# EAGLE design mtp zesilovac (EAGLE 7.2.0)
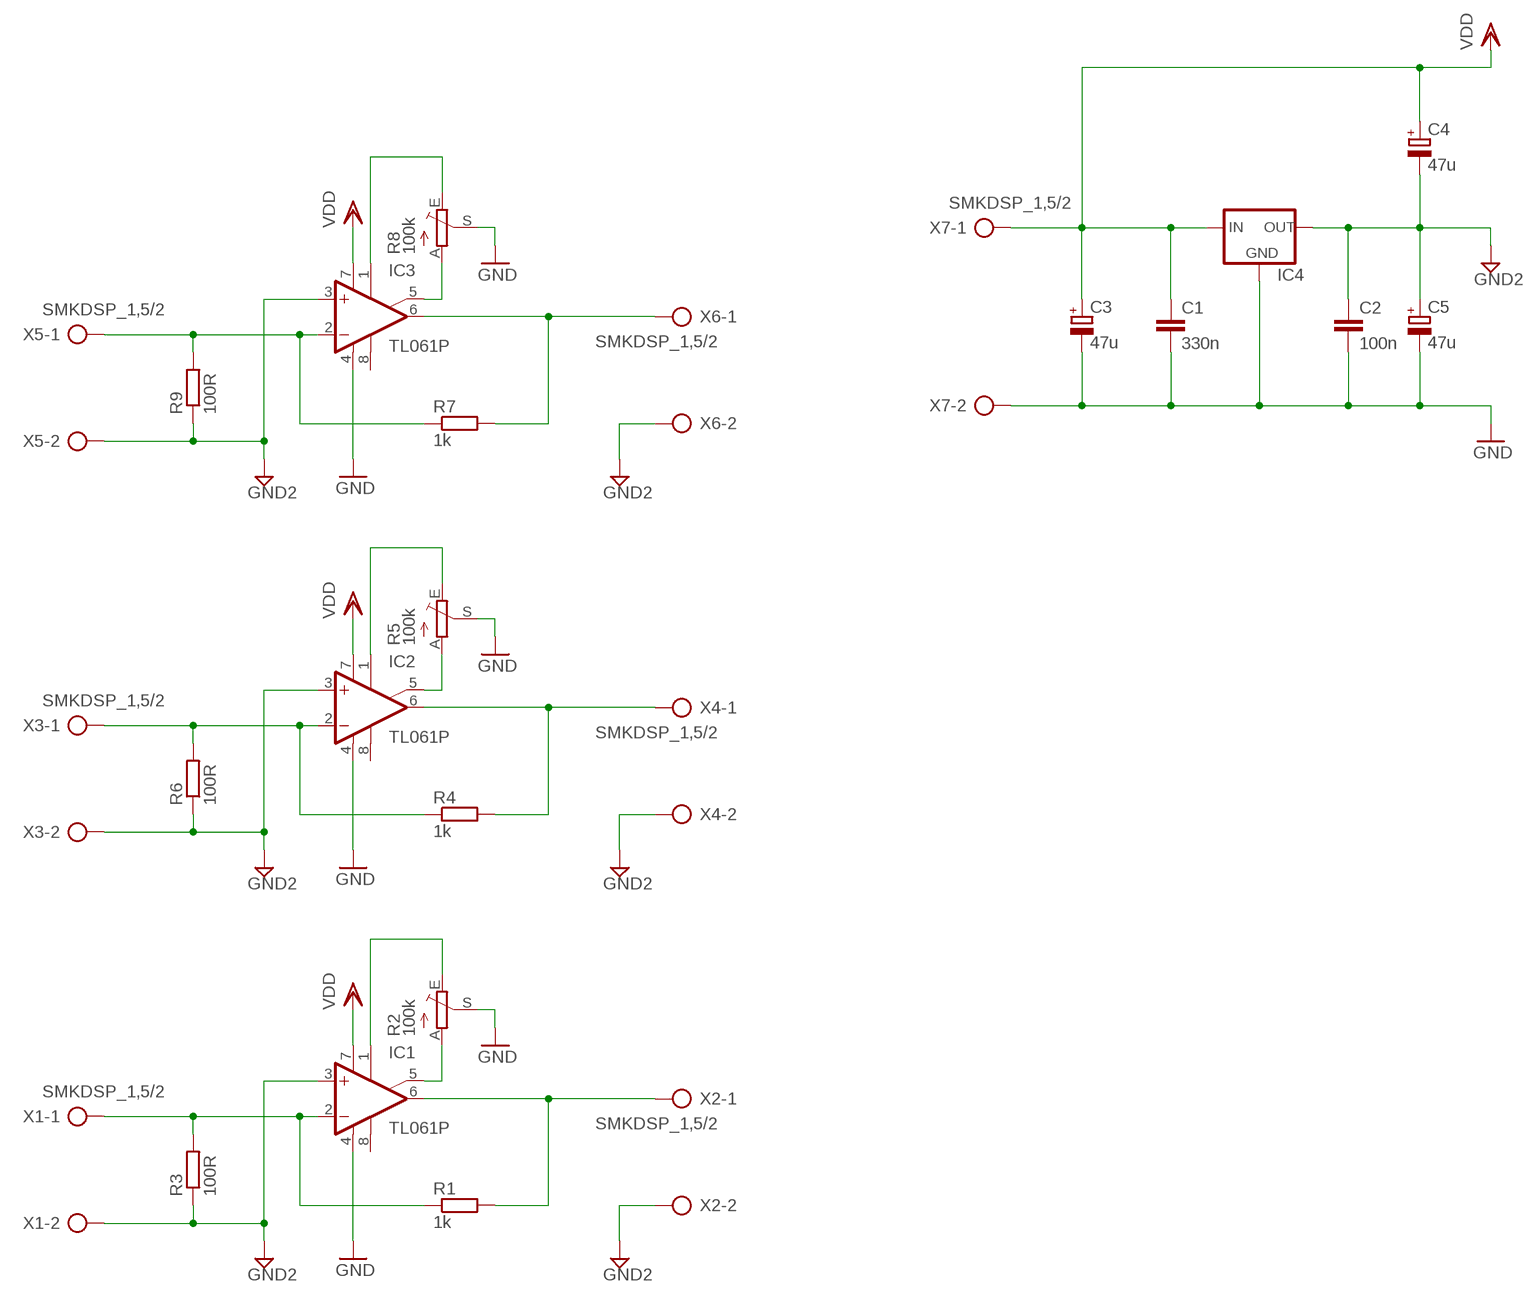
[diagram p0: schematic, sheet 1]

## Parts
C1  330n  C-EU050-045X075  [C050-045X075]
C2  100n  C-EU050-045X075  [C050-045X075]
C3  47u  CPOL-EUE2.5-7  [E2,5-7]
C4  47u  CPOL-EUE2.5-7  [E2,5-7]
C5  47u  CPOL-EUE2.5-7  [E2,5-7]
IC1  TL061P  [DIL08]
IC2  TL061P  [DIL08]
IC3  TL061P  [DIL08]
IC4  78LXX  [78LXX]
R1  1k  R-EU_0207/12  [0207/12]
R2  100k  TRIM_EU-LI10  [LI10]
R3  100R  R-EU_0207/12  [0207/12]
R4  1k  R-EU_0207/12  [0207/12]
R5  100k  TRIM_EU-LI10  [LI10]
R6  100R  R-EU_0207/12  [0207/12]
R7  1k  R-EU_0207/12  [0207/12]
R8  100k  TRIM_EU-LI10  [LI10]
R9  100R  R-EU_0207/12  [0207/12]
X1  SMKDSP_1,5/2  [SMKDSP_1,5/2]
X2  SMKDSP_1,5/2  [SMKDSP_1,5/2]
X3  SMKDSP_1,5/2  [SMKDSP_1,5/2]
X4  SMKDSP_1,5/2  [SMKDSP_1,5/2]
X5  SMKDSP_1,5/2  [SMKDSP_1,5/2]
X6  SMKDSP_1,5/2  [SMKDSP_1,5/2]
X7  SMKDSP_1,5/2  [SMKDSP_1,5/2]

## Nets
GND: C1.2 C2.2 C3.- C5.- IC1.4(V-) IC2.4(V-) IC3.4(V-) IC4.GND R2.S R5.S R8.S X7.2
GND2: C2.1 C4.- C5.+ IC1.3(+IN) IC2.3(+IN) IC3.3(+IN) IC4.OUT R3.1 R6.1 R9.1 X1.2 X2.2 X3.2 X4.2 X5.2 X6.2
N$1: IC1.2(-IN) R1.1 R3.2 X1.1
N$2: IC1.6(OUT) R1.2 X2.1
N$3: IC1.5(ON2) R2.A
N$4: IC1.1(ON1) R2.E
N$5: IC2.2(-IN) R4.1 R6.2 X3.1
N$6: IC2.6(OUT) R4.2 X4.1
N$7: IC2.5(ON2) R5.A
N$8: IC2.1(ON1) R5.E
N$9: IC3.2(-IN) R7.1 R9.2 X5.1
N$10: IC3.6(OUT) R7.2 X6.1
N$11: IC3.5(ON2) R8.A
N$12: IC3.1(ON1) R8.E
VDD: C1.1 C3.+ C4.+ IC1.7(V+) IC2.7(V+) IC3.7(V+) IC4.IN X7.1
Unconnected: IC1.8(OPT) IC2.8(OPT) IC3.8(OPT)

## Library data of the parts
C1 C2 = rcl:C-EU: CAPACITOR, European symbol
C3-C5 = rcl:CPOL-EU: POLARIZED CAPACITOR, European symbol
IC1-IC3 = linear:TL061: OP AMP
IC4 = v-reg:78LXX: VOLTAGE REGULATOR
R1 R3 R4 R6 R7 R9 = rcl:R-EU_: RESISTOR, European symbol
R2 R5 R8 = pot:TRIM_EU-: POTENTIOMETER
X1-X7 = con-phoenix-smkdsp:SMKDSP_1,5/2: Printklemme, Nennstrom: 17,5 A, Bemessungsspannung: 250 V, Raster: 5,0 mm Source: http://eshop.phoenixcontact.de .. 1733415.pdf; MF: FARNELL; MPN: 1733570; OC_FARNELL: 3041244; OC_NEWARK: 69C8588

## Board
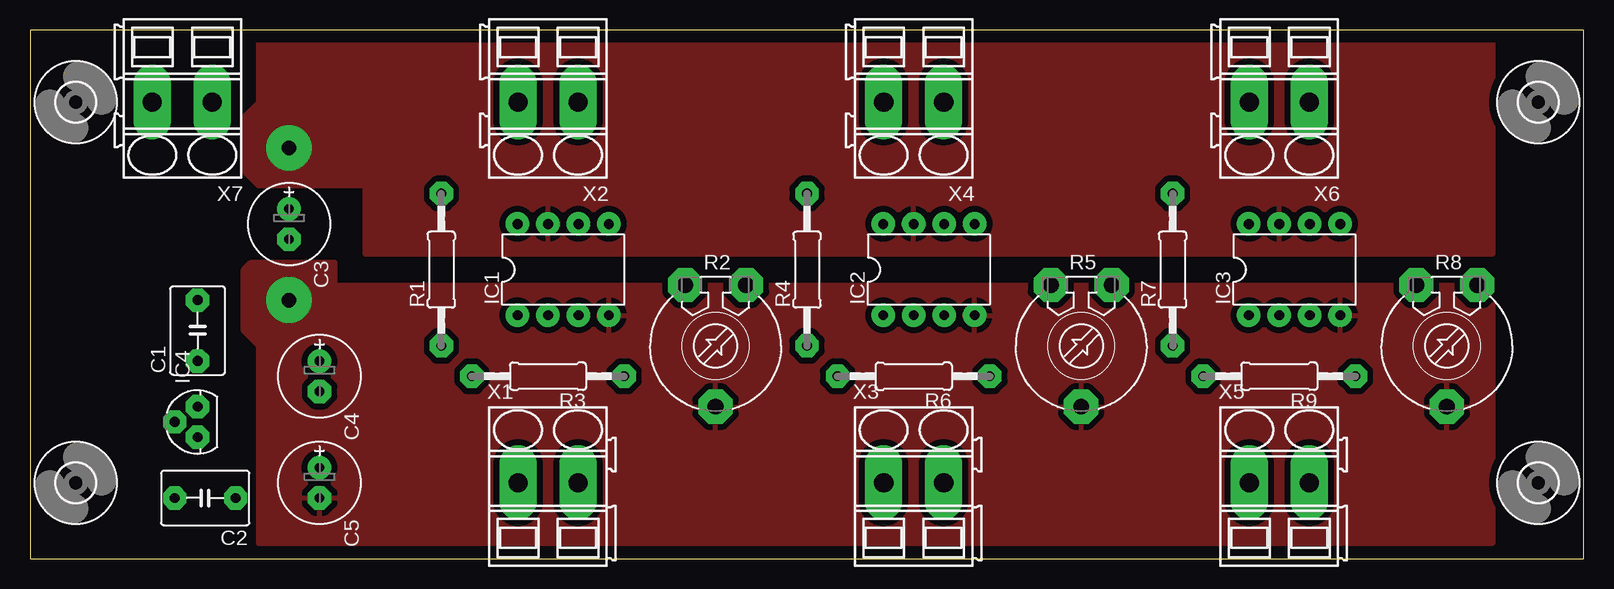
[diagram p1: board, top side]
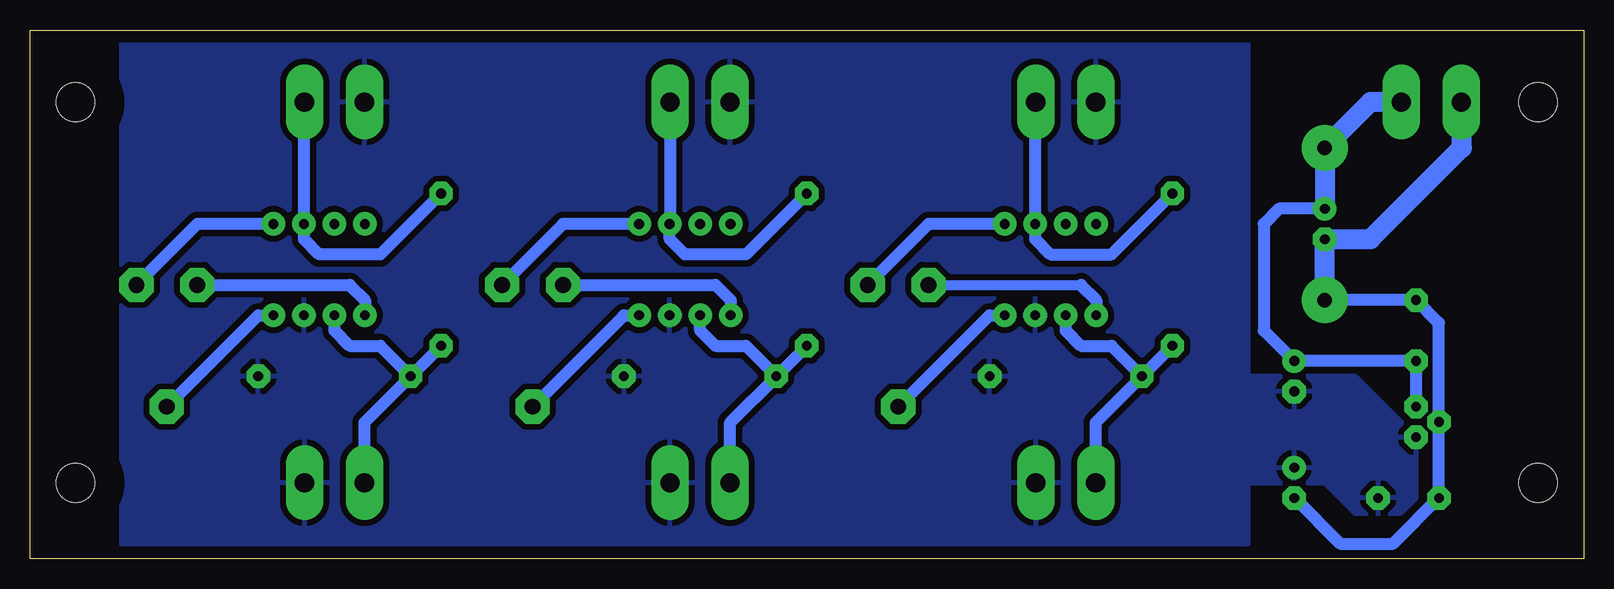
[diagram p2: board, bottom side, seen from below]

Size 129.52 x 44.12 mm. Coordinates in mm from the lower left corner, seen from the top.
Outline: 0,0 129.52,0 129.52,44.12 0,44.12 0,0
Copper layers (1*16): Top 0.035mm / dielectric 1.5mm / Bottom 0.035mm
Design rules "default *": minimum track width 10mil, minimum drill 24mil, track to track 20mil, track to pad 20mil, pad to pad 20mil, via to via 20mil, smd to smd 8mil, copper to edge 40mil, drill to drill 8mil, minimum pad ring 20mil, minimum via ring 8mil, stop-mask expansion 4mil, vias tented up to drill 0mil, thermal gap 20mil

### Footprints (pad centres in the part's own frame; a part is rotated, then mirrored left to right if it is on the bottom)
C050-045X075 = drill 0.813 octagon: 1 -2.54,0; 2 2.54,0
E2,5-7 = drill 0.813 pad 1.6: + -1.27,0 | drill 0.813 pad 1.6 octagon: - 1.27,0
DIL08 = drill 0.813 pad 1.27: 1 -3.81,-3.81; 2 -1.27,-3.81; 3 1.27,-3.81; 4 3.81,-3.81; 5 3.81,3.81; 6 1.27,3.81; 7 -1.27,3.81; 8 -3.81,3.81
78LXX = drill 0.813 octagon: GND 0,1.905; IN 1.27,0; OUT -1.27,0
0207/12 = drill 0.813 octagon: 1 -6.35,0; 2 6.35,0
LI10 = drill 1.321 octagon: A -2.54,-5.08; E 2.54,-5.08; S 0,5.08
3,2 = hole 3.2: 0,0
SMKDSP_1,5/2 = drill 1.6 pad 1.8 long: 1 -2.5,0; 2 2.5,0

### Placement (x,y rotation side)
C1  13.97,19.05 90 top
C2  14.61,5.08 180 top
C3  21.59,27.94 270 top
C4  24.13,15.24 270 top
C5  24.13,6.35 270 top
IC1  44.45,24.13 0 top
IC2  74.93,24.13 0 top
IC3  105.41,24.13 0 top
IC4  13.97,11.43 90 top
R1  34.29,24.13 90 top
R2  57.15,17.78 180 top
R3  43.18,15.24 180 top
R4  64.77,24.13 90 top
R5  87.63,17.78 180 top
R6  73.66,15.24 180 top
R7  95.25,24.13 90 top
R8  118.11,17.78 180 top
R9  104.14,15.24 180 top
U$1  [3,2]  3.81,38.1 0 top
U$2  [3,2]  3.81,6.35 0 top
U$3  [3,2]  125.73,6.35 0 top
U$4  [3,2]  125.73,38.1 0 top
X1  43.18,6.35 0 top
X2  43.18,38.1 180 top
X3  73.66,6.35 0 top
X4  73.66,38.1 180 top
X5  104.14,6.35 0 top
X6  104.14,38.1 180 top
X7  12.7,38.1 180 top

### Tracks (layer width: path | path; a pad name or v marks a point on that pad's centre or on a via)
GND  (via drill 1.2 pad 3.81)
  Bottom 0.813: 10.16,38.06 X7.2
  Bottom 1.016: C5.- 20.32,1.27 15.88,1.27 C2.2 IC4.GND 12.06,19.68 C1.2 v21.59,21.59 | R2.S 49.53,20.32 IC1.4 | R5.S 80.01,20.32 IC2.4 | R8.S 110.49,20.32 IC3.4
  Bottom 1.676: 10.16,38.06 10.16,34.29 17.78,26.67 C3.- v21.59,21.59
  pour Top: 19.05,24.77 25.4,24.77 25.4,22.86 121.92,22.86 121.92,1.27 19.05,1.27 19.05,17.78 17.78,19.05 17.78,24.13 18.41,24.77
GND2
  pour Bottom: 121.92,1.27 27.94,1.27 27.94,6.35 21.59,6.35 19.05,3.81 15.24,3.81 13.97,5.08 13.97,10.16 19.05,15.24 27.94,15.24 27.94,43.18 121.92,43.18
N$1
  Bottom 1.016: X1.1 40.68,11.39 R3.2 | IC1.2 43.18,19.05 41.91,17.78 39.37,17.78 R3.2 | R3.2 R1.1
N$2
  Bottom 0.813: 45.72,38.06 X2.1
  Bottom 1.016: 45.72,38.06 IC1.6 45.72,26.67 44.45,25.4 39.37,25.4 R1.2
N$3
  Bottom 1.016: IC1.5 54.61,27.94 R2.A
N$4
  Bottom 0.813: R2.E 41.91,22.86
  Bottom 1.016: 41.91,22.86 40.64,21.59 IC1.1
N$5
  Bottom 1.016: X3.1 71.16,11.39 R6.2 | IC2.2 73.66,19.05 72.39,17.78 69.85,17.78 R6.2 | R6.2 R4.1
N$6
  Bottom 0.813: 76.16,27.98 IC2.6
  Bottom 1.016: X4.1 76.16,27.98 | IC2.6 76.2,26.67 74.93,25.4 69.85,25.4 R4.2
N$7
  Bottom 1.016: IC2.5 85.09,27.94 R5.A
N$8
  Bottom 1.016: R5.E 72.39,22.86 71.12,21.59 IC2.1
N$9
  Bottom 1.016: X5.1 101.64,11.39 R9.2 | IC3.2 104.14,19.05 102.87,17.78 100.33,17.78 R9.2 | R9.2 R7.1
N$10
  Bottom 0.813: 106.68,39.33 X6.1
  Bottom 1.016: 106.68,39.33 IC3.6 106.68,26.67 105.41,25.4 100.33,25.4 R7.2
N$11
  Bottom 1.016: IC3.5 115.57,27.94 R8.A
N$12
  Bottom 1.016: R8.E 102.87,22.86 101.6,21.59 IC3.1
VDD  (via drill 1.2 pad 3.81)
  Bottom 1.016: C3.+ 25.4,29.21 26.67,27.94 26.67,19.05 C4.+ C1.1 IC4.IN
  Bottom 1.676: X7.1 17.78,38.1 v21.59,34.29 C3.+
  pour Top: 19.05,31.11 17.78,32.38 17.78,36.83 19.05,38.1 19.05,43.18 121.92,43.18 121.92,25.4 27.94,25.4 27.94,31.11